# EAGLE schematic Temp Schematic (EAGLE 9.6.2)
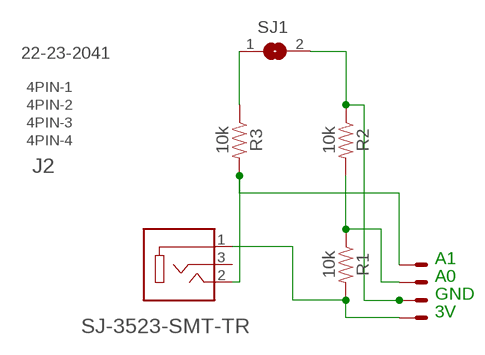
[diagram p0: schematic, sheet 1]

## Parts
4PIN  22-23-2041  [22-23-2041]
J2  SJ-3523-SMT-TR  [CUI_SJ-3523-SMT-TR]
R1  10k  10KOHM-HORIZ-1/4W-5%  [AXIAL-0.3]
R2  10k  10KOHM-HORIZ-1/4W-5%  [AXIAL-0.3]
R3  10k  10KOHM-HORIZ-1/4W-5%  [AXIAL-0.3]
SJ1  SJ  [SJ]

## Nets
N$1: 4PIN.4 J2.1 R1.P$2
N$3: 4PIN.2 R1.P$1 R2.P$2
N$4: R3.P$1 SJ1.1
N$5: 4PIN.3 R2.P$1 SJ1.2
N$6: 4PIN.1 J2.2 R3.P$2
Unconnected: J2.3

## Notes on the sheet
- A1
- A0
- GND
- 3V

## Library data of the parts
4PIN = con-molex:22-23-2041: .100" (2.54mm) Center Header - 4 Pin; MF: MOLEX; MPN: 22-23-2041; OC_FARNELL: 1462920; OC_NEWARK: 38C0355
J2 = SJ-3523-SMT-TR:SJ-3523-SMT-TR: Audio Jack Connector 3.5 mm Low Profile Surface Mount Stereo Jack, 3 Pin Right-Angle Check availability <https://pricing.snapeda.com/parts/SJ-3523-SMT-TR/CUI%20Devices/view-part?ref=eda>; AVAILABILITY: In Stock; CUI_PURCHASE_URL: https://www.cuidevices.com/product/interconnect/connectors/audio-connectors/jacks/sj-352x-smt-series?utm_source=snapeda.com&utm_medium=referral&utm_campaign=snapedaBOM; DESCRIPTION: 3.5 mm, Stereo, Right Angle, Surface Mount (SMT), 3 Conductors, 0~1 Internal Switches, Audio Jack Connector; MF: CUI Devices; MP: SJ-3523-SMT-TR; PACKAGE: None; PRICE: None; PURCHASE-URL: https://pricing.snapeda.com/search/part/SJ-3523-SMT-TR/?ref=eda
R1-R3 = SparkFun-Resistors:10KOHM: 10kΩ resistor A resistor is a passive two-terminal electrical component that implements electrical resistance as a circuit element. Resistors act to reduce current flow, and, at the same time, act to lower voltage levels within circuits. - Wikipedia; PROD_ID: RES-09435
SJ1 = jumper:SJ: SMD solder JUMPER